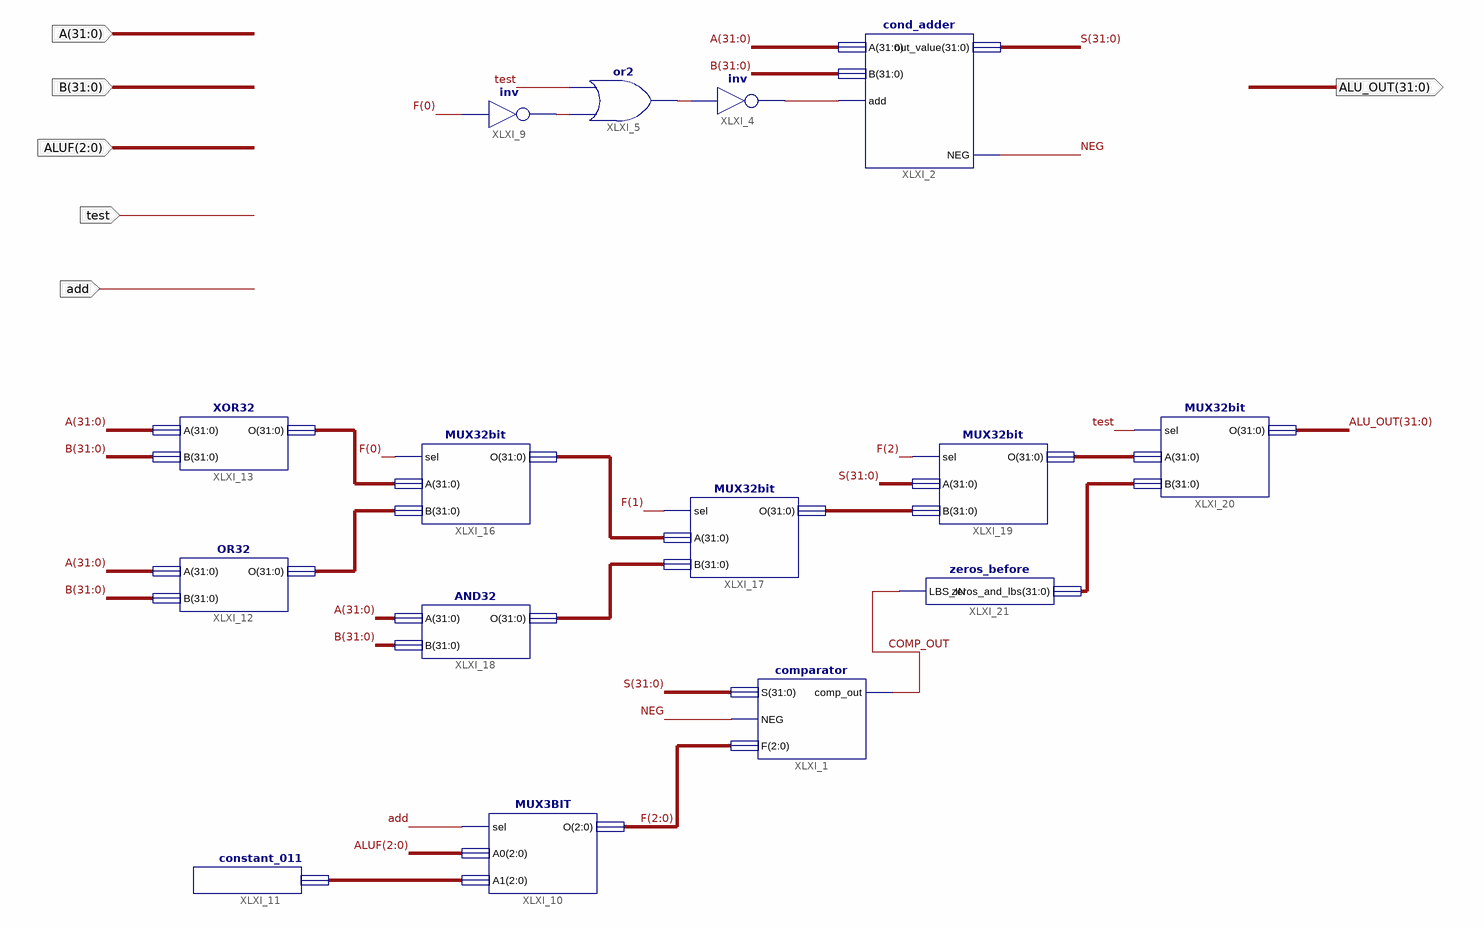
[diagram p0: schematic sheet 1]
// Xilinx ISE schematic ALU_env.sch (spartan6) as structural Verilog: 15 symbols, 6 ports
module ALU_env (
  input  [31:0] A,
  input  [31:0] B,
  input  test,
  input  add,
  input  [2:0] ALUF,
  output [31:0] ALU_OUT
);

  wire COMP_OUT, NEG, XLXN_6, XLXN_12, XLXN_21;
  wire [2:0] F, XLXN_24;
  wire [31:0] S, XLXN_35, XLXN_36, XLXN_38, XLXN_42, XLXN_43, XLXN_46, XLXN_47;

  cond_adder XLXI_2 (.add(XLXN_6), .A(A), .B(B), .out_value(S), .NEG(NEG));
  not XLXI_4 (XLXN_6, XLXN_12);
  or XLXI_5 (XLXN_12, XLXN_21, test);
  not XLXI_9 (XLXN_21, F[0]);
  MUX3BIT XLXI_10 (.sel(add), .A0(ALUF), .A1(XLXN_24), .O(F));
  constant_011 XLXI_11 (.out_011(XLXN_24));
  OR32 XLXI_12 (.A(A), .B(B), .O(XLXN_36));
  XOR32 XLXI_13 (.A(A), .B(B), .O(XLXN_35));
  MUX32bit XLXI_16 (.sel(F[0]), .A(XLXN_35), .B(XLXN_36), .O(XLXN_38));
  MUX32bit XLXI_17 (.sel(F[1]), .A(XLXN_38), .B(XLXN_42), .O(XLXN_43));
  AND32 XLXI_18 (.A(A), .B(B), .O(XLXN_42));
  MUX32bit XLXI_19 (.sel(F[2]), .A(S), .B(XLXN_43), .O(XLXN_46));
  MUX32bit XLXI_20 (.sel(test), .A(XLXN_46), .B(XLXN_47), .O(ALU_OUT));
  zeros_before XLXI_21 (.LBS_IN(COMP_OUT), .zeros_and_lbs(XLXN_47));
  comparator XLXI_1 (.S(S), .NEG(NEG), .F(F), .comp_out(COMP_OUT));
endmodule
